# Altium schematic sheet Power.SchDoc
size A
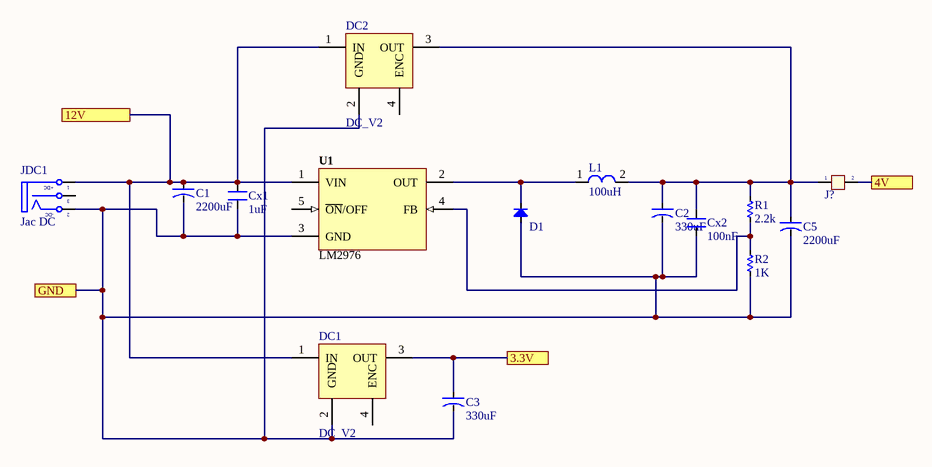
[diagram p0: Power.SchDoc]

## Parts
C1  2200uF  [CA-ALU-5]
C2  330uF  [CA-ALU-5]
C3  330uF  [CA-ALU-5]
C5  2200uF  [CA-ALU-5]
Cx1  1uF  [CN-SMD-0805]
Cx2  100nF  [CN-SMD-0805]
D1  MBR340  [DIO-5AN]  (value not drawn)
DC1  DC_V2  [DC_V2]
DC2  DC_V2  [DC_V2]
J?  Jumper 2  [JP2]  (value not drawn)
JDC1  Jac DC  [DC0]
L1  100uH  [L-SMD-M-12x10]
R1  2.2k  [RES-SMD-0805]
R2  1K  [RES-SMD-0805]
U1  LM2976  [TO263]

## Ports
3.3V, 4V, 12V, GND

## Nets
3.3V: C3.1 DC1.3(OUT) ; port 3.3V
4V: J?.2 ; port 4V
12V: C1.1 Cx1.2 DC1.1(IN) DC2.1(IN) JDC1.1(T) U1.1(VIN) ; port 12V
GND: C1.2 C2.2 C3.2 C5.2 Cx1.1 Cx2.1 D1.1(A) DC1.2(GND) DC2.2(GND) JDC1.2(TN) R2.2 U1.3(GND) ; port GND
NetC2_1: C2.1 C5.1 Cx2.2 DC2.3(OUT) J?.1 L1.2 R1.1
NetD1_2: D1.2(K) L1.1 U1.2(OUT)
NetR1_2: R1.2 R2.1 U1.4(FB)

Not connected (* = marked no-connect by the designer): DC1 4(ENC); DC2 4(ENC); JDC1 3(S); U1 5(~{ON}/OFF)

## Notes on the sheet
- (in symbol DCIN) +DC; -DC

## Library data of the parts
C1-C3 C5 = CN-ALU-DIP: Capacitor (Semiconductor SIM Model); Value: 104; LatestRevisionDate: 17-Jul-2002; LatestRevisionNote: Re-released for DXP Platform.; PackageReference: C1206; Publisher: Altium Limited
Cx1 Cx2 = CN: Value: 33pF
D1 = Diode: Default Diode; Code - JEDEC: DO-214-AB; Value: 1N5007; Published: 8-Jun-2000; Revision: July-2002: Re-released for DXP Platform.; Publisher: Altium Limited
DC1 DC2 = DC_Module_V2
J? = JP 2: Value: JP 2
JDC1 = DCIN: Jac DC input; Value: Jac DC
L1 = L-SMD-1: partNo: 78477010; Manufacturer: Wurth Elektronik; Inductance: 1.0 μH; ComponentLink1Description: Manufacturer; ComponentLink1URL: http://www.we-online.de; Created by: Baojun Chen; Created Date: Nov.2015; ComponentLink2Description: Datasheet; ComponentLink2URL: http://katalog.we-online.de/pbs/datasheet/78477010.pdf
R1 R2 = Res-SMD: Resistor; Manufacturer: Generic Components; Class: Passive; Published: 08/06/2000; Publisher: Altium Hobart Technology Centre
U1 = LM2596: Max Input Voltage: 12 V; Max Output Current: 3 (6.0 peak) A; Max Output Voltage: mV; Category: IC-Power; Min Input Voltage: mV; Min Output Voltage: mV; Mounting Technology: Surface Mount; Status: Unreleased; Supply Voltage: mV; Temperature Range: -40 to +125 degC